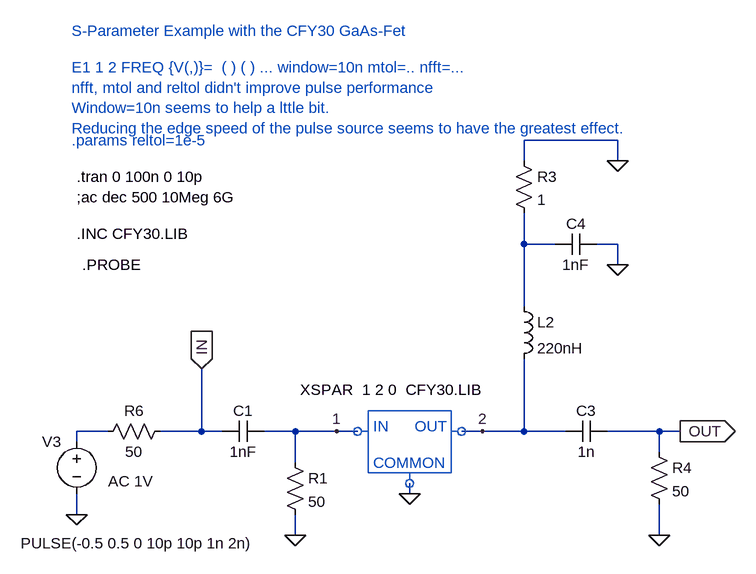
[diagram p0: schematic cfy30_test.asc]
cfy30_test.asc, the LTspice schematic file:
Version 4
SHEET 1 1048 740
WIRE 400 64 400 16
WIRE 400 64 400 160
WIRE -160 352 -96 352
WIRE 0 352 48 352
WIRE 608 464 608 512
WIRE 448 64 400 64
WIRE 512 64 544 64
WIRE 544 64 544 96
WIRE 400 -96 400 -64
WIRE 400 352 400 240
WIRE 224 432 224 448
WIRE 608 352 608 384
WIRE 528 352 608 352
WIRE 464 352 400 352
WIRE -288 448 -288 480
WIRE -288 368 -288 352
WIRE -288 352 -240 352
WIRE 48 400 48 352
WIRE 48 352 112 352
WIRE 48 480 48 512
WIRE 544 -64 544 -96
WIRE 544 -96 400 -96
WIRE 304 352 336 352
WIRE 112 352 144 352
WIRE 336 352 400 352
WIRE 608 352 640 352
WIRE -96 352 -96 256
WIRE -96 352 -64 352
FLAG 608 512 0
FLAG 544 96 0
FLAG -96 256 IN
IOPIN -96 256 In
FLAG 640 352 OUT
IOPIN 640 352 Out
FLAG 224 448 0
FLAG -288 480 0
FLAG 48 512 0
FLAG 544 -64 0
FLAG 112 352 1
FLAG 336 352 2
SYMBOL cap -64 368 R270
WINDOW 0 32 32 VTop 0
WINDOW 3 0 32 VBottom 0
SYMATTR InstName C1
SYMATTR Value 1nF
SYMBOL cap 464 368 R270
WINDOW 0 32 32 VTop 0
WINDOW 3 0 32 VBottom 0
SYMATTR InstName C3
SYMATTR Value 1n
SYMBOL ind 384 144 R0
SYMATTR InstName L2
SYMATTR Value 220nH
SYMBOL res 384 -80 R0
SYMATTR InstName R3
SYMATTR Value 1
SYMBOL res 592 368 R0
SYMATTR InstName R4
SYMATTR Value 50
SYMBOL res -256 368 R270
WINDOW 0 32 56 VTop 0
WINDOW 3 0 56 VBottom 0
SYMATTR InstName R6
SYMATTR Value 50
SYMBOL cap 448 80 R270
WINDOW 0 32 32 VTop 0
WINDOW 3 0 32 VBottom 0
SYMATTR InstName C4
SYMATTR Value 1nF
SYMBOL voltage -288 352 M0
WINDOW 3 -273 172 Left 0
WINDOW 123 -117 77 Left 0
WINDOW 39 24 44 Left 0
SYMATTR Value PULSE(-0.5 0.5 0 10p 10p 1n 2n)
SYMATTR Value2 AC 1V
SYMATTR InstName V3
SYMBOL res 32 384 R0
SYMATTR InstName R1
SYMATTR Value 50
TEXT -288 -8 Left 0 !;ac dec 500 10Meg 6G
TEXT -288 -40 Left 0 !.tran 0 100n 0 10p
TEXT -288 48 Left 0 !.INC CFY30.LIB
TEXT 168 344 Left 0 ;IN
TEXT 232 344 Left 0 ;OUT
TEXT 168 400 Left 0 ;COMMON
TEXT 56 288 Left 0 !XSPAR  1 2 0  CFY30.LIB
TEXT -280 96 Left 0 !.PROBE
TEXT -296 -96 Left 0 ;.params reltol=1e-5
TEXT -296 -208 Left 0 ;E1 1 2 FREQ {V(,)}=  ( ) ( ) ... window=10n mtol=.. nfft=...\nnfft, mtol and reltol didn't improve pulse performance\nWindow=10n seems to help a lttle bit.\nReducing the edge speed of the pulse source seems to have the greatest effect.
TEXT -296 -264 Left 0 ;S-Parameter Example with the CFY30 GaAs-Fet
LINE Normal 160 352 150 352
LINE Normal 160 352 160 352
LINE Normal 298 352 288 352
LINE Normal 224 416 224 426
RECTANGLE Normal 288 416 160 320
CIRCLE Normal 150 358 138 346
CIRCLE Normal 310 358 298 346
CIRCLE Normal 230 438 218 426

The netlist it stands for:
* cfy30_test.asc
C1 IN 1 1nF
C3 2 OUT 1n
L2 N001 2 220nH
R3 0 N001 1
R4 OUT 0 50
R6 N002 IN 50
C4 N001 0 1nF
V3 N002 0 PULSE(-0.5 0.5 0 10p 10p 1n 2n) AC 1V
R1 1 0 50
;ac dec 500 10Meg 6G
.tran 0 100n 0 10p
.INC CFY30.LIB
* IN
* OUT
* COMMON
XSPAR  1 2 0  CFY30.LIB
.PROBE
* .params reltol=1e-5
* E1 1 2 FREQ {V(,)}=  ( ) ( ) ... window=10n mtol=.. nfft=...
* nfft, mtol and reltol didn't improve pulse performance
* Window=10n seems to help a lttle bit.
* Reducing the edge speed of the pulse source seems to have the greatest effect.
* S-Parameter Example with the CFY30 GaAs-Fet
.backanno
.end